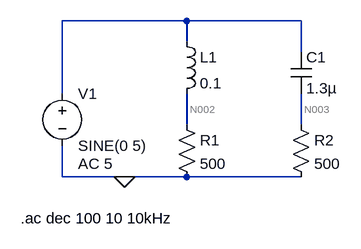
[diagram p0: schematic CrossOver.asc]
CrossOver.asc, the LTspice schematic file:
Version 4.1
SHEET 1 880 680
WIRE 208 0 16 0
WIRE 384 0 208 0
WIRE 208 32 208 0
WIRE 384 48 384 0
WIRE 16 112 16 0
WIRE 208 160 208 112
WIRE 384 160 384 112
WIRE 16 240 16 192
WIRE 112 240 16 240
WIRE 208 240 112 240
WIRE 384 240 208 240
FLAG 112 240 0
SYMBOL voltage 16 96 R0
WINDOW 123 24 124 Left 2
WINDOW 39 0 0 Left 0
SYMATTR InstName V1
SYMATTR Value SINE(0 5)
SYMATTR Value2 AC 5
SYMBOL ind 192 16 R0
SYMATTR InstName L1
SYMATTR Value 0.1
SYMATTR SpiceLine Rser=1m
SYMBOL cap 368 48 R0
SYMATTR InstName C1
SYMATTR Value 1.3µ
SYMBOL res 192 144 R0
SYMATTR InstName R1
SYMATTR Value 500
SYMBOL res 368 144 R0
SYMATTR InstName R2
SYMATTR Value 500
TEXT -48 304 Left 2 !.ac dec 100 10 10kHz

The netlist it stands for:
* CrossOver.asc
V1 N001 0 SINE(0 5) AC 5
L1 N001 N002 0.1 Rser=1m
C1 N001 N003 1.3µ
R1 N002 0 500
R2 N003 0 500
.ac dec 100 10 10kHz
.backanno
.end

* Results of the author's LTspice run, read from the files saved beside the schematic
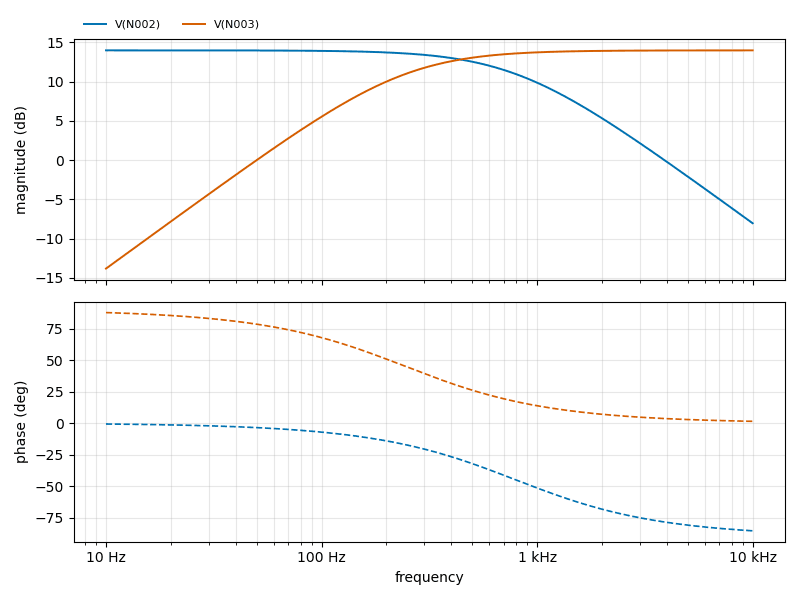
[diagram p1: AC Analysis of CrossOver.asc, plotted from the saved traces]
* AC Analysis, 1 run:
*   V(N002): 13.98 dB at 10 Hz, -8.03 dB at 10 kHz, peak 13.98 dB at 10 Hz, 3 dB below the peak at 795.9 Hz
*   V(N003): -13.81 dB at 10 Hz, 13.98 dB at 10 kHz, peak 13.98 dB at 10 kHz, 3 dB below the peak at 244.7 Hz